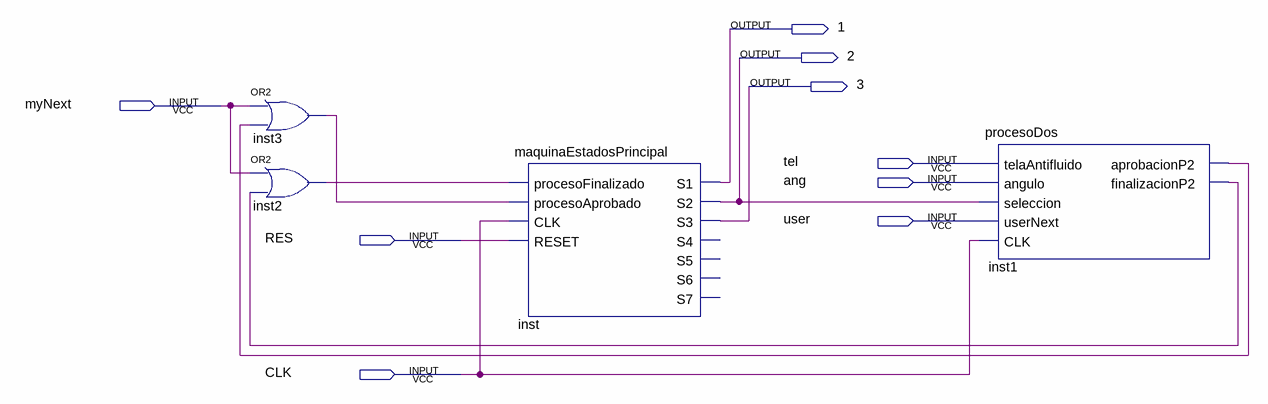
[diagram p0: schematic sheet]
// Quartus schematic provis.bdf as structural Verilog: 4 symbols, 9 pins
module provis (
  input  myNext,
  input  tel,
  input  ang,
  input  user,
  input  RES,
  input  CLK,
  output \1 ,
  output \2 ,
  output \3 
);

  wire inst1_aprobacionp2, inst1_finalizacionp2, inst2_out, inst3_out;

  or inst3 (inst3_out, myNext, inst1_aprobacionp2);
  or inst2 (inst2_out, myNext, inst1_finalizacionp2);
  maquinaEstadosPrincipal inst (
    .procesoFinalizado(inst2_out), .procesoAprobado(inst3_out), .CLK(CLK), .RESET(RES), .S1(\1 ), .S2(\2 ),
    .S3(\3 ));  // open: S4, S5, S6, S7
  procesoDos inst1 (
    .telaAntifluido(tel), .angulo(ang), .seleccion(\2 ), .userNext(user), .CLK(CLK),
    .aprobacionP2(inst1_aprobacionp2), .finalizacionP2(inst1_finalizacionp2));
endmodule
